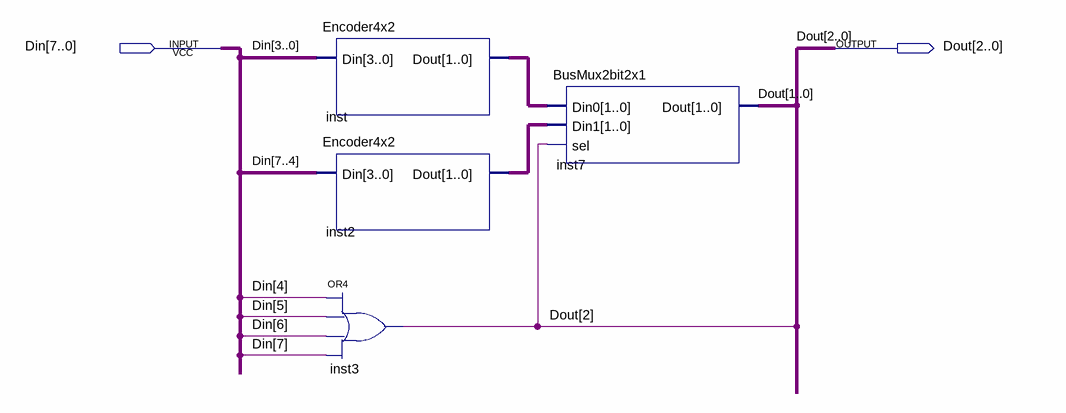
[diagram p0: schematic sheet]
// Quartus schematic OneHotDecoder3.bdf as structural Verilog: 4 symbols, 2 pins
module OneHotDecoder3 (
  input  [7:0] Din,
  output [2:0] Dout
);

  wire [1:0] inst2_dout, inst_dout;

  Encoder4x2 inst (.Din(Din[3:0]), .Dout(inst_dout));
  Encoder4x2 inst2 (.Din(Din[7:4]), .Dout(inst2_dout));
  or inst3 (Dout[2], Din[4], Din[5], Din[6], Din[7]);
  BusMux2bit2x1 inst7 (.Din0(inst_dout), .Din1(inst2_dout), .sel(Dout[2]), .Dout(Dout[1:0]));
endmodule
